# Altium schematic sheet dc_sense.SchDoc
size A3; SheetNumber: 3; SheetTotal: 3
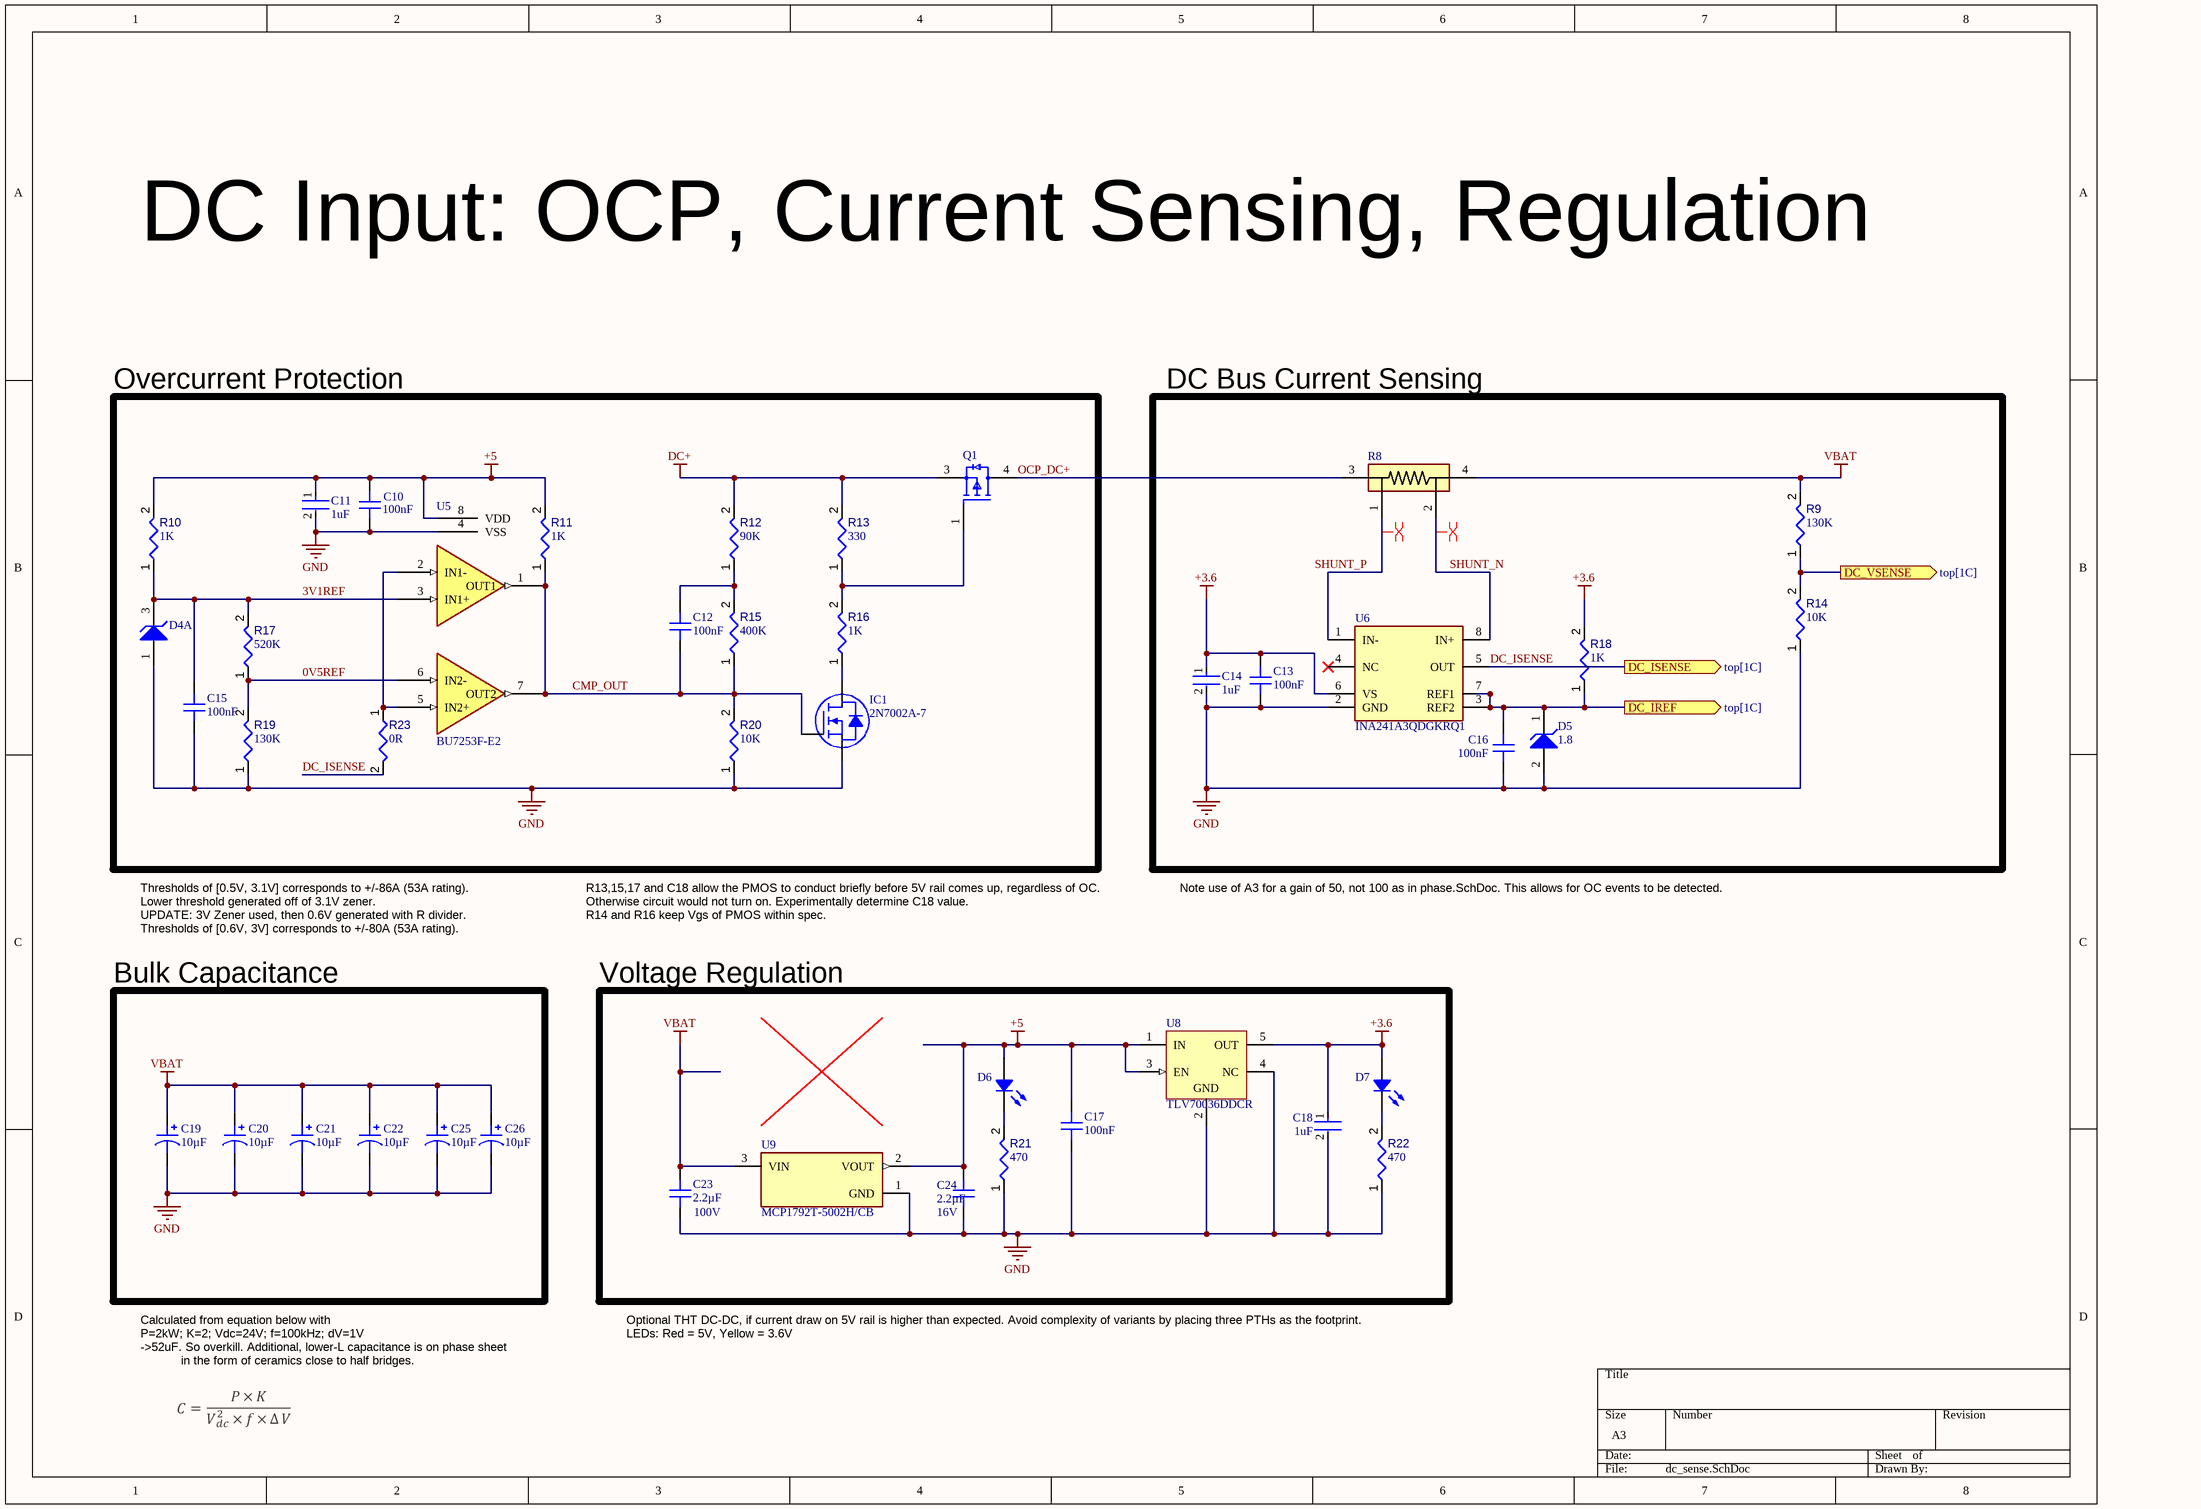
[diagram p0: dc_sense.SchDoc]

## Parts
C10  value 100nF  [CAPC0402(1005)33_L]  (hidden comment: CL05B104KO5NNNC)
C11  1uF  [FP-GRM155-0_05-MFG]
C12  value 100nF  [CAPC0402(1005)33_L]  (hidden comment: CL05B104KO5NNNC)
C13  value 100nF  [CAPC0402(1005)33_L]  (hidden comment: CL05B104KO5NNNC)
C14  1uF  [FP-GRM155-0_05-MFG]
C15  value 100nF  [CAPC0402(1005)33_L]  (hidden comment: CL05B104KO5NNNC)
C16  value 100nF  [CAPC0402(1005)33_L]  (hidden comment: CL05B104KO5NNNC)
C17  value 100nF  [CAPC0402(1005)33_L]  (hidden comment: CL05B104KO5NNNC)
C18  1uF  [FP-GRM155-0_05-MFG]
C19  value 10µF  [CAP ALSMD 8.3MM H10.5MM]  (hidden comment: UUX2A100MNL1GS)
C20  value 10µF  [CAP ALSMD 8.3MM H10.5MM]  (hidden comment: UUX2A100MNL1GS)
C21  value 10µF  [CAP ALSMD 8.3MM H10.5MM]  (hidden comment: UUX2A100MNL1GS)
C22  value 10µF  [CAP ALSMD 8.3MM H10.5MM]  (hidden comment: UUX2A100MNL1GS)
C23  value 2.2µF  Voltage - Rated: 100V  [CAP 1206_3216 - 0.8MM]  (hidden comment: AC1206KKX7R0BB225)
C24  value 2.2µF  Voltage - Rated: 16V  [CAP 0603_1608]  (hidden comment: KGM15BR51C225KM)
C25  value 10µF  [CAP ALSMD 8.3MM H10.5MM]  (hidden comment: UUX2A100MNL1GS)
C26  value 10µF  [CAP ALSMD 8.3MM H10.5MM]  (hidden comment: UUX2A100MNL1GS)
D4  SZBZX84C3V0ET1G  [ONSC-SOT-23-3-318-08_V]  (value not drawn)  (part A of 2)
D5  VZ Typ (V): 1.8  [ONSC-SOD-123-2-425-04_V]  (hidden comment: SZMMSZ4678T1G)
D6  150060BS55040  [LED 0603_1608 BLUE]  (value not drawn)
D7  150060BS55040  [LED 0603_1608 BLUE]  (value not drawn)
IC1  2N7002A-7  [DIODES SOT-23-3]
Q1  SQM100P10-19L_GE3  [FP-T13-0707-MFG]  (value not drawn)
R8  PU2726FKMPD0U3L  [PU2726FKMPD0U3L]  (value not drawn)
R9  value 130K  [RESC0603(1608)_L]  (hidden comment: 120R3J)
R10  value 1K  [RESC0603(1608)_L]  (hidden comment: 120R3J)
R11  value 1K  [RESC0603(1608)_L]  (hidden comment: 120R3J)
R12  value 90K  [RESC0603(1608)_L]  (hidden comment: 120R3J)
R13  value 330  [RESC0603(1608)_L]  (hidden comment: 120R3J)
R14  value 10K  [RESC0603(1608)_L]  (hidden comment: 120R3J)
R15  value 400K  [RESC0603(1608)_L]  (hidden comment: 120R3J)
R16  value 1K  [RESC0603(1608)_L]  (hidden comment: 120R3J)
R17  value 520K  [RESC0603(1608)_L]  (hidden comment: 120R3J)
R18  value 1K  [RESC0603(1608)_L]  (hidden comment: 120R3J)
R19  value 130K  [RESC0603(1608)_L]  (hidden comment: 120R3J)
R20  value 10K  [RESC0603(1608)_L]  (hidden comment: 120R3J)
R21  value 470  [RESC0603(1608)_L]  (hidden comment: 120R3J)
R22  value 470  [RESC0603(1608)_L]  (hidden comment: 120R3J)
R23  value 0R  [RESC0603(1608)_L]  (hidden comment: 120R3J)
U5  BU7253F-E2  [SOP8_ROM]
U6  INA241A3QDGKRQ1  [SOIC127P600X175-8N]
U8  TLV70036DDCR  [DDC0005A_L]
U9  MCP1792T-5002H/CB  [FP-C04-130-IPC_C]

## Blocks framed on the sheet
Overcurrent Protection: C10-C12 C15 D4 IC1 Q1 R10-R13 R15-R17 R19 R20 R23 U5
DC Bus Current Sensing: C13 C14 C16 D5 R8 R9 R14 R18 U6
Bulk Capacitance: C19-C22 C25 C26
Voltage Regulation: C17 C18 C23 C24 D6 D7 R21 R22 U8 U9

## Ports
DC_IREF (out, see top[1C]), DC_ISENSE (out, see top[1C]), DC_VSENSE (out, see top[1C])

## Nets
+3.6: C13.2 C14.1 C18.1 D7.1 R18.2 U6.6(VS) U8.5(OUT)
+5: C10.2 C11.1 C17.2 C24.2 D6.1 R10.2 R11.2 U5.8(VDD) U8.1(IN) U8.3(EN) U9.2(VOUT)
DC+: Q1.3(S) R12.2 R13.2
GND: C10.1 C11.2 C13.1 C14.2 C15.1 C16.1 C17.1 C18.2 C19.2 C20.2 C21.2 C22.2 C23.1 C24.1 C25.2 C26.2 D4.1(A) D5.2(A) IC1.2(S) R14.1 R19.1 R20.1 R21.1 R22.1 U5.4(VSS) U6.2(GND) U8.2(GND) U8.4(NC) U9.1(GND)
VBAT: C19.1 C20.1 C21.1 C22.1 C23.2 C25.1 C26.1 R8.4 R9.2 U9.3(VIN)
0V5REF: R17.1 R19.2 U5.6(IN2-)
3V1REF: C15.2 D4.3(K) R10.1 R17.2 U5.3(IN1+)
CMP_OUT: C12.1 IC1.1(G) R11.1 R15.1 R20.2 U5.1(OUT1) U5.7(OUT2)
DC_IREF: C16.2 D5.1(K) R18.1 U6.3(REF2) U6.7(REF1) ; port DC_IREF
DC_ISENSE: R23.2 U6.5(OUT) ; port DC_ISENSE
DC_VSENSE: R9.1 R14.2 ; port DC_VSENSE
OCP_DC+: Q1.4(D) R8.3
SHUNT_N: R8.2 U6.8(IN+)
SHUNT_P: R8.1 U6.1(IN-)
NetC12_2: C12.2 R12.1 R15.2
NetD6_2: D6.2 R21.2
NetD7_2: D7.2 R22.2
NetIC1_3: IC1.3(D) R16.1
NetQ1_1: Q1.1(G) R13.1 R16.2
NetR23_1: R23.1 U5.2(IN1-) U5.5(IN2+)

Not connected (* = marked no-connect by the designer): U6 4(NC)*

## Layout directives
differential pair: SHUNT_N, SHUNT_P

## Notes on the sheet
- DC Input: OCP, Current Sensing, Regulation
- Thresholds of [0.5V, 3.1V] corresponds to +/-86A (53A rating).
- Lower threshold generated off of 3.1V zener.
- UPDATE: 3V Zener used, then 0.6V generated with R divider.
- R13,15,17 and C18 allow the PMOS to conduct briefly before 5V rail comes up, regardless of OC.
- Otherwise circuit would not turn on. Experimentally determine C18 value.
- R14 and R16 keep Vgs of PMOS within spec.
- Note use of A3 for a gain of 50, not 100 as in phase.SchDoc. This allows for OC events to be detected.
- Thresholds of [0.6V, 3V] corresponds to +/-80A (53A rating).
- Calculated from equation below with
- Optional THT DC-DC, if current draw on 5V rail is higher than expected. Avoid complexity of variants by placing three PTHs as the footprint.
- P=2kW; K=2; Vdc=24V; f=100kHz; dV=1V
- ->52uF. So overkill. Additional, lower-L capacitance is on phase sheet
- in the form of ceramics close to half bridges.
- LEDs: Red = 5V, Yellow = 3.6V

## Library data of the parts
C10 C12 C13 C15-C17 = CMP-001-35390-2: CAP CER 0.1UF 16V X7R 0402; manufacturer: Samsung Electro-Mechanics; Tolerance: 10%; ComponentLink2URL: https://www.digikey.com/en/products/detail/samsung-electro-mechanics/CL05B104KO5NNNC/3886659; Lifecycle Status: Active; lastupdated: 2/9/2024 8:04:31 PM; price: 0.01; Case/Package: 0402 (1005 Metric); series: CL; Mounting Type: Surface Mount, MLCC; ComponentLink1URL: http://www.samsungsem.com/kr/support/product-search/mlcc/CL05B104KO5NNNC.jsp; ComponentLink2Description: DigiKey Link; Part Status: Active; Part Number: CL05B104KO5NNNC; Thickness (Max): 0.022" (0.55mm); packaging: CutTape; Temperature Coefficient: X7R; Applications: General Purpose; Voltage - Rated: 16V; Device Package: 0402 (1005 Metric); Size / Dimension: 0.039" L x 0.020" W (1.00mm x 0.50mm); ComponentLink1Description: Datasheet; Operating Temperature: -55°C ~ 125°C; Minimum Order: 1; partid: 6066
C11 C14 C18 = CMP-06035-012136-1: Chip Multilayer Ceramic Capacitors for General Purpose, 0402, 1.0uF, B, 10%, 20%, 16V
C19-C22 C25 C26 = CMP-001-00511-1: CAP ALUM 10UF 20% 100V SMD; manufacturer: Nichicon; Polarization: Polar; Surface Mount Land Size: 0.327" L x 0.327" W (8.30mm x 8.30mm); Ripple Current @ Low Frequency: 75 mA @ 120 Hz; Lifetime @ Temp.: 2000 Hrs @ 105°C; Ripple Current @ High Frequency: 125.25 mA @ 10 kHz; Operating Temperature: -55°C ~ 105°C; price: 0.12; Case/Package: Radial, Can - SMD; Mounting Type: Surface Mount; Lifecycle Status: Active; Applications: General Purpose; lastupdated: 6/3/2024 8:15:48 PM; ComponentLink1Description: Datasheet; series: UUX; packaging: TapeAndReel; Tolerance: 20%; Minimum Order: 1; partid: 7531; Voltage - Rated: 100V; ComponentLink2URL: https://www.digikey.com/en/products/detail/nichicon/UUX2A100MNL1GS/2550555; Part Status: Active; ComponentLink1URL: http://nichicon-us.com/english/products/pdfs/e-uux.pdf; ComponentLink2Description: DigiKey Link; Height - Seated (Max): 0.413" (10.50mm); Device Package: Radial, Can - SMD; Part Number: UUX2A100MNL1GS; Size / Dimension: 0.315" Dia (8.00mm)
C23 = CMP-001-64876-1: CAP CER 2.2UF 100V X7R 1206; manufacturer: Yageo; Tolerance: 10%; price: 0.31; ComponentLink1URL: https://www.yageo.com/upload/media/product/productsearch/datasheet/mlcc/UPY-AC_HiCap_X7R_0.pdf; partid: 52346; Thickness (Max): 0.071" (1.80mm); Mounting Type: Surface Mount, MLCC; Ratings: AEC-Q200; ComponentLink1Description: Datasheet; ComponentLink2URL: https://www.digikey.com/en/products/detail/yageo/AC1206KKX7R0BB225/16797723; Operating Temperature: -55°C ~ 125°C; series: AC; lastupdated: 6/4/2024 7:10:05 PM; Temperature Coefficient: X7R; Size / Dimension: 0.126" L x 0.063" W (3.20mm x 1.60mm); Device Package: 1206 (3216 Metric); Part Number: AC1206KKX7R0BB225; ComponentLink2Description: DigiKey Link; Lifecycle Status: Active; Applications: Automotive; Minimum Order: 1; Case/Package: 1206 (3216 Metric); Part Status: Active; packaging: TapeAndReel
C24 = CMP-001-48803-2: CAP CER 2.2UF 16V X5R 0603; manufacturer: KYOCERA AVX; Tolerance: 10%; Part Number: KGM15BR51C225KM; series: KGM - X5R; lastupdated: 2/9/2024 8:09:11 PM; Size / Dimension: 0.063" L x 0.031" W (1.60mm x 0.80mm); ComponentLink2Description: DigiKey Link; Operating Temperature: -55°C ~ 85°C; ComponentLink1URL: https://datasheets.kyocera-avx.com/cx5r.pdf; Mounting Type: Surface Mount, MLCC; Part Status: Active; ComponentLink1Description: Datasheet; partid: 53097; Lifecycle Status: Active; price: 0.04; Device Package: 0603 (1608 Metric); Thickness (Max): 0.037" (0.95mm); Case/Package: 0603 (1608 Metric); packaging: TapeAndReel; Applications: General Purpose; ComponentLink2URL: https://www.digikey.com/en/products/detail/kyocera-avx/KGM15BR51C225KM/9749268; Temperature Coefficient: X5R; Minimum Order: 1
D4 = CMP-1060-01187-1: Zener Voltage Regulator, 225 mW, 3-Pin SOT-23, Pb-Free, Tape and Reel; Manufacturer: On Semiconductor; PackageReference: SOT-23-3-318-08; ComponentLink1Description: Manufacturer URL; ComponentLink3URL: http://www.onsemi.cn/pub_link/Collateral/318-08.PDF; Packing: Tape and Reel; ComponentLink3Description: Package Specification; RoHS: Pb-Free; ComponentLink2Description: Datasheet; PackageDescription: 3-Pin Small Outline Transistor, Body 2.92 x 1.3 mm, Pitch 0.95 mm; DatasheetVersion: Rev. 8; PackageVersion: Rev. AP, 11/2009; ComponentLink1URL: http://www.onsemi.com/; Mounting Technology: Surface Mount; ComponentLink2URL: http://www.onsemi.com/pub_link/Collateral/BZX84C2V4ET1-D.PDF; PartNumber: SZBZX84C3V0ET1G
D5 = CMP-1060-00510-1: Zener Voltage Regulator, 500 mW, 2-Pin SOD-123, Pb-Free, Tape and Reel; Manufacturer: On Semiconductor; P Max (W): 0.5; PartNumber: SZMMSZ4678T1G; PackageDescription: 2-Pin SOD, Body 1.6 x 2.69 mm; Mounting Technology: Surface Mount; ComponentLink2URL: http://www.onsemi.com/pub_link/Collateral/MMSZ4678T1-D.PDF; ComponentLink1URL: http://www.onsemi.com/; DatasheetVersion: Rev. 9; PackageVersion: Rev. G, 10/2009; ComponentLink3Description: Package Specification; ComponentLink2Description: Datasheet; Packing: Tape and Reel; ComponentLink3URL: http://www.onsemi.com/pub_link/Collateral/425-04.PDF; RoHS: Pb-Free; PackageReference: SOD-123-2-425-04; ComponentLink1Description: Manufacturer URL
D6 D7 = CMP-004-14535-2: LED BLUE DIFFUSED 0603 SMD; Manufacturer: Würth Elektronik; Current - Test: 20mA; Voltage - Forward (Vf) (Typ): 3.2V; Configuration: Standard; Lens Color: 0.50mm; Lens Style: Rectangle with Flat Top; Millicandela Rating: 80mcd; Lens Size: 1.00mm x 0.80mm; Viewing Angle: 140°; Wavelength - Peak: 465nm; Wavelength - Dominant: 470nm; LastUpdated: 6/3/2024 7:57:52 PM; Part Number: 150060BS55040; Color: Blue; Device Package: 0603 (1608 Metric); Lifecycle Status: Active; PartId: 796; Size / Dimension: 1.60mm L x 0.80mm W; Part Status: Active; ComponentLink1Description: Datasheet; Value: Blue; ComponentLink2URL: https://www.digikey.com/en/products/detail/würth-elektronik/150060BS55040/8557178; Height (Max): 0.50mm; ComponentLink1URL: https://www.we-online.de/web/en/index.php/download/media/07_electronic_components/download_center_1/application_notes_berichte/ano002_leds___the_future_of_horticultural_lighting/ANO002b_EN_LEDs_The_Future_of_Horticultural_Lighting.pdf; Series: WL-SMCD; Lens Transparency: Diffused; Case/Package: 0603 (1608 Metric); Mounting Type: Surface Mount; Packaging: TapeAndReel; Supplier Device Package: 0603 (1608 Metric); Price: 0.11; Minimum Order: 1; ComponentLink2Description: DigiKey Link
IC1 = CMP-031-01263-1: MOSFET N-CH 60V 180MA SOT23; Manufacturer: Diodes Incorporated; Current - Continuous Drain (Id) @ 25°C: 180mA (Ta); Drive Voltage (Max Rds On,  Min Rds On): 5V, 10V; Input Capacitance (Ciss) (Max) @ Vds: 23 pF @ 25 V; Power Dissipation (Max): 370mW (Ta); FET Type: N-Channel; Vgs(th) (Max) @ Id: 2V @ 250µA; Vgs (Max): ±20V; Rds On (Max) @ Id, Vgs: 6Ohm @ 115mA, 5V; Lifecycle Status: Active; Minimum Order: 1; Case/Package: TO-236-3, SC-59, SOT-23-3; Supplier Device Package: SOT-23-3; Part Status: Active; Operating Temperature: -55°C ~ 150°C (TJ); ComponentLink1Description: Datasheet; Series: -; Price: 0.03; ComponentLink2Description: DigiKey Link; Technology: MOSFET (Metal Oxide); ComponentLink1URL: https://www.diodes.com/assets/Datasheets/ds31360.pdf; Packaging: TapeAndReel; ComponentLink2URL: https://www.digikey.com/en/products/detail/diodes-incorporated/2N7002A-7/3451498; Part Number: 2N7002A-7; Mounting Type: Surface Mount; Drain to Source Voltage (Vdss): 60 V; LastUpdated: 6/3/2024 8:15:17 PM
Q1 = CMP-02550-000324-1: MOSFET P-CH 100V 93A TO263
R8 = CMP-1021-000000-2: Thick Film Resistors - SMD 0.3mOhms 11W 2726 1% 75ppm Shunt AEC-Q200; Manufacturer_Name: Yageo Group; Geometry.Height: 3.7mm; Mouser Part Number: *; Datasheet Link: https://www.yageogroup.com/content/datasheet/asset/file/PYU-PU2726_ROHS_L; Arrow Price/Stock: *; Mouser Price/Stock: *; Manufacturer_Part_Number: PU2726FKMPD0U3L; Arrow Part Number: *; Source: PU2726FKMPD0U3L.SchLib; Design Item ID: PU2726FKMPD0U3L
R9-R23 = CMP-009-00069-2: 120R 0.1W 5% 0603 (1608 Metric)  SMD; Power: 100mW; Mounting Technology: SMT; Tolerance: 5%; Case/Package: 0603; Pins: 2
U5 = CMP-059-000001-3: Comparator, Open Drain, 5V; Mfr_Name: ROHM Semiconductor; Type: Type; Design Item ID: BU7253F-E2; RefDes: RefDes; Source: BU7253F-E2.SchLib
U6 = CMP-014-00011-1: Current Sense Amplifiers AEC-Q100, -4-V to 110-V bidirectional ultraprecise current sense amp with enhanced PWM rejection 8-VSSOP -40 to 125; Manufacturer_Name: Texas Instruments; Geometry.Height: 1.1mm; Manufacturer_Part_Number: INA241A3QDGKRQ1; Datasheet Link: https://www.ti.com/lit/ds/symlink/ina241a-q1.pdf?ts=1710247494397&ref_url=https%253A%252F%252Fwww.ti.com%252Fproduct%252FINA241A-Q1%252Fpart-details%252FINA241A4QDGKRQ1; Mouser Part Number: 595-INA241A3QDGKRQ1; Source: INA241A4QDGKRQ1.SchLib; Design Item ID: INA241A3QDGKRQ1; Mouser Price/Stock: https://www.mouser.co.uk/ProductDetail/Texas-Instruments/INA241A3QDGKRQ1?qs=HoCaDK9Nz5fDURPmL7Cdag%3D%3D
U8 = CMP-0394-01051-2: Single Output LDO, 200 mA, Fixed 3.6 V Output, 2 to 5.5 V Input, with Low IQ, 5-pin SOT (DDC), -40 to 125 degC, Green (RoHS & no Sb/Br); Manufacturer: Texas Instruments; Vout Adj(Max)(V): 3.6; Vin(Min)(V): 2; Iout(Max)(A): 0.2; Iq(Typ)(mA): 0.03; Vin(Max)(V): 5.5; Vdo(Typ)(mV): 175; SubFamily: Single Channel LDO; ComponentLink1Description: Manufacturer URL; Vout Adj(Min)(V): 3.6; DatasheetVersion: SLVSA00D; Mounting Technology: Surface Mount; ComponentLink2Description: Datasheet; ComponentLink3URL: http://www.ti.com/litv/pdf/mpds123d; ComponentLink3Description: Package Specification; Eco-Plan: Green (RoHS & no Sb/Br); PackageReference: DDC0005A; ComponentLink1URL: http://www.ti.com/; ComponentLink2URL: http://www.ti.com/general/docs/lit/getliterature.tsp?genericPartNumber=TLV70036&fileType=pdf; PackageDescription: 5-Pin Plastic Small Outline, Body 2.9 x 1.6 mm, 0.95 mm Pitch; Code_JEDEC: MO-193; PackageVersion: 4204403-2/E; Fixed Output Options(V): 3.6; Accuracy(%): 2; PartNumber: TLV70036DDCR
U9 = CMP-06324-000131-1: IC REG LINEAR 5V 100MA SOT23A-3; Max Supply Current: 150uA; Power Supply Rejection Ratio (PSRR): 55dB; Max Input Voltage: 55V; Number of Regulators: 1; Output Configuration: Positive; Output Type: Fixed; Quiescent Current: 45uA; Case/Package: TO-236-3; Max Operating Temperature: 150°C; Min Operating Temperature: -40°C; RoHS Compliant: Yes; Output Current: 100mA; Series: Automotive, AEC-Q100; Mount: Surface Mount; Min Output Voltage: 5V